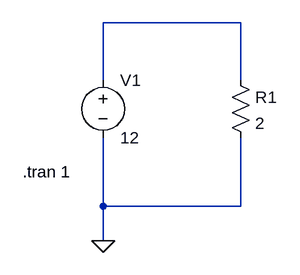
[diagram p0: schematic lab1.asc]
lab1.asc, the LTspice schematic file:
Version 4
SHEET 1 880 680
WIRE 144 -48 -48 -48
WIRE -48 32 -48 -48
WIRE 144 32 144 -48
WIRE -48 208 -48 112
WIRE 144 208 144 112
WIRE 144 208 -48 208
WIRE -48 256 -48 208
FLAG -48 256 0
SYMBOL voltage -48 16 R0
WINDOW 123 0 0 Left 0
WINDOW 39 0 0 Left 0
SYMATTR InstName V1
SYMATTR Value 12
SYMBOL res 128 16 R0
SYMATTR InstName R1
SYMATTR Value 2
TEXT -160 160 Left 2 !.tran 1

The netlist it stands for:
* lab1.asc
V1 N001 0 12
R1 N001 0 2
.tran 1
.backanno
.end